# Altium schematic sheet mcu2.SchDoc
size A4
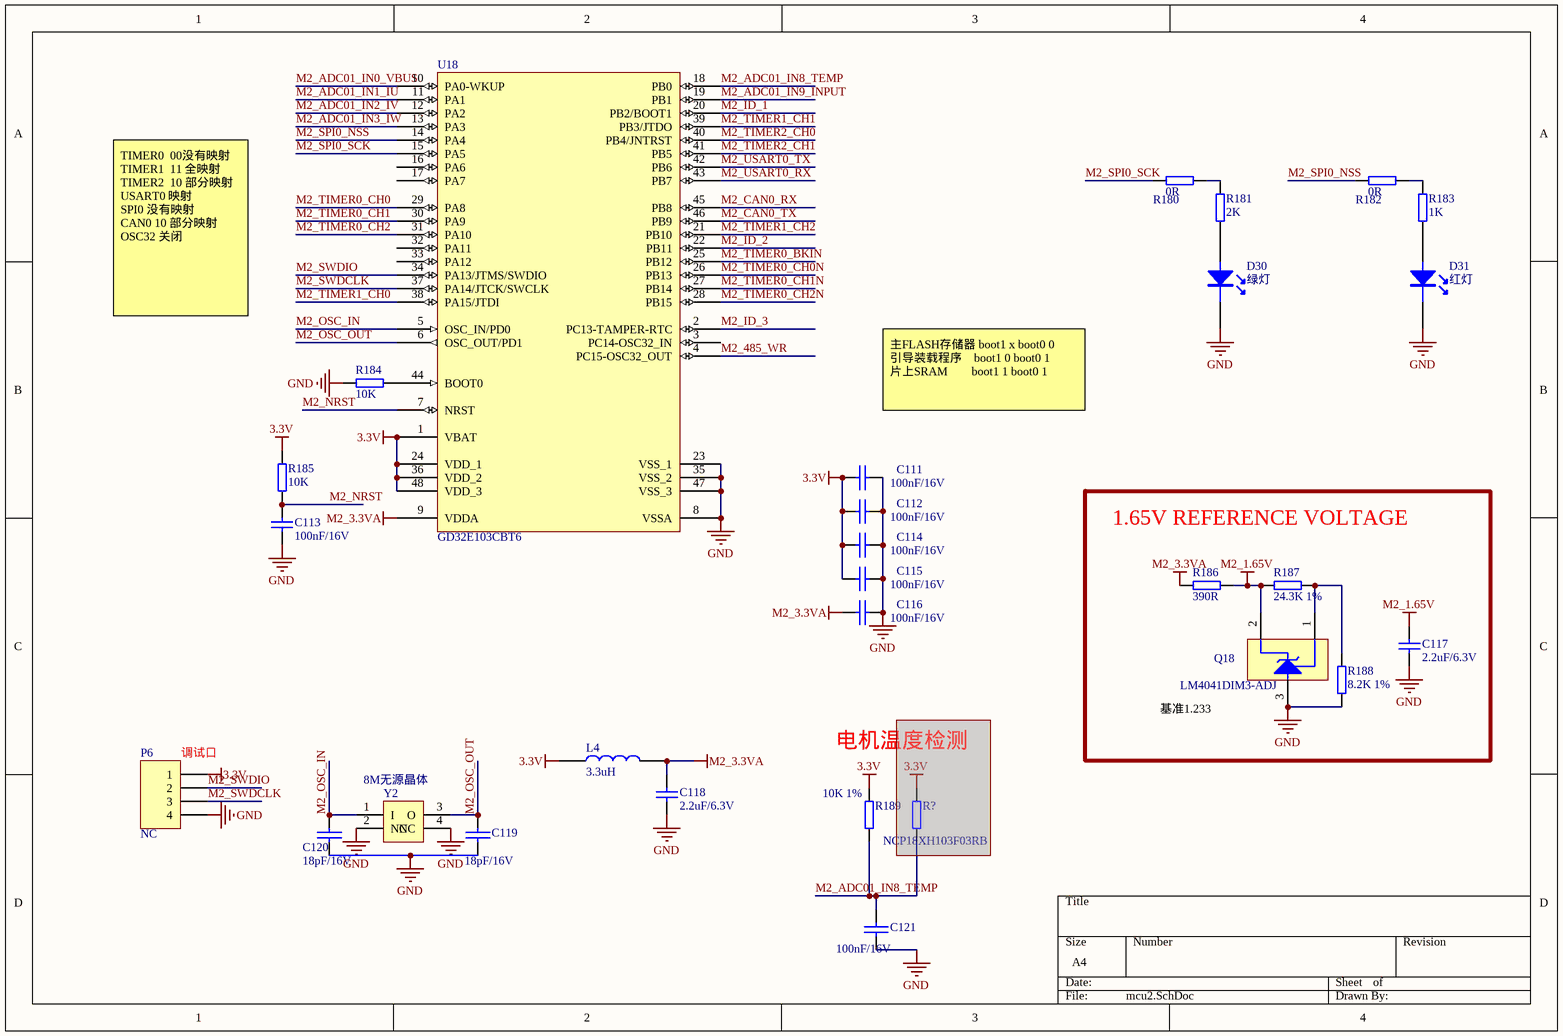
[diagram p0: mcu2.SchDoc]

## Parts
C111  100nF/16V  [C0402]
C112  100nF/16V  [C0402]
C113  100nF/16V  [C0402]
C114  100nF/16V  [C0402]
C115  100nF/16V  [C0402]
C116  100nF/16V  [C0402]
C117  2.2uF/6.3V  [C0402]
C118  2.2uF/6.3V  [C0402]
C119  18pF/16V  [C0402]
C120  18pF/16V  [C0402]
C121  100nF/16V  [C0402]
D30  绿灯  [LED_0603]
D31  红灯  [LED_0603]
L4  3.3uH  [L0603]
P6  NC  [2.0*4]
Q18  LM4041DIM3-ADJ  [SOT-23]
R180  0R  [R0603]
R181  2K  [R0402]
R182  0R  [R0603]
R183  1K  [R0402]
R184  10K  [R0402]
R185  10K  [R0402]
R186  390R  [R0603]
R187  24.3K 1%  [R0402]
R188  8.2K 1%  [R0402]
R189  10K 1%  [R0402]
R?  NCP18XH103F03RB  [R0603]  (masked out: inside a compile mask, not in the netlist)
U18  GD32E103CBT6  [LQFP-48]
Y2  8M无源晶体  [5032 4pin]

## Blocks framed on the sheet
1.65V REFERENCE VOLTAGE: C117 Q18 R186-R188

## Nets
3.3V: C111.2 C112.2 C114.2 C115.2 L4.1 P6.1 R185.2 R189.2 U18.1(VBAT) U18.24(VDD_1) U18.36(VDD_2) U18.48(VDD_3)
GND: C111.1 C112.1 C113.1 C114.1 C115.1 C116.1 C117.1 C118.1 C119.1 C120.1 C121.2 D30.2(K) D31.2(K) P6.4 Q18.3 R184.1 R188.2 U18.8(VSSA) U18.23(VSS_1) U18.35(VSS_2) U18.47(VSS_3) Y2.2(NC) Y2.4(NC)
M2_1.65V: C117.2 Q18.2 R186.2 R187.1
M2_3.3VA: C116.2 C118.2 L4.2 R186.1 U18.9(VDDA)
M2_485_WR: U18.4(PC15-OSC32_OUT)
M2_ADC01_IN0_VBUS: U18.10(PA0-WKUP)
M2_ADC01_IN1_IU: U18.11(PA1)
M2_ADC01_IN2_IV: U18.12(PA2)
M2_ADC01_IN3_IW: U18.13(PA3)
M2_ADC01_IN8_TEMP: C121.1 R189.1 U18.18(PB0)
M2_ADC01_IN9_INPUT: U18.19(PB1)
M2_CAN0_RX: U18.45(PB8)
M2_CAN0_TX: U18.46(PB9)
M2_ID_1: U18.20(PB2/BOOT1)
M2_ID_2: U18.22(PB11)
M2_ID_3: U18.2(PC13-TAMPER-RTC)
M2_NRST: C113.2 R185.1 U18.7(NRST)
M2_OSC_IN: C120.2 U18.5(OSC_IN/PD0) Y2.1(I)
M2_OSC_OUT: C119.2 U18.6(OSC_OUT/PD1) Y2.3(O)
M2_SPI0_NSS: R182.2 U18.14(PA4)
M2_SPI0_SCK: R180.2 U18.15(PA5)
M2_SWDCLK: P6.3 U18.37(PA14/JTCK/SWCLK)
M2_SWDIO: P6.2 U18.34(PA13/JTMS/SWDIO)
M2_TIMER0_BKIN: U18.25(PB12)
M2_TIMER0_CH0: U18.29(PA8)
M2_TIMER0_CH0N: U18.26(PB13)
M2_TIMER0_CH1: U18.30(PA9)
M2_TIMER0_CH1N: U18.27(PB14)
M2_TIMER0_CH2: U18.31(PA10)
M2_TIMER0_CH2N: U18.28(PB15)
M2_TIMER1_CH0: U18.38(PA15/JTDI)
M2_TIMER1_CH1: U18.39(PB3/JTDO)
M2_TIMER1_CH2: U18.21(PB10)
M2_TIMER2_CH0: U18.40(PB4/JNTRST)
M2_TIMER2_CH1: U18.41(PB5)
M2_USART0_RX: U18.43(PB7)
M2_USART0_TX: U18.42(PB6)
NetD30_1: D30.1(A) R181.2
NetD31_1: D31.1(A) R183.2
NetQ18_1: Q18.1 R187.2 R188.1
NetR180_1: R180.1 R181.1
NetR182_1: R182.1 R183.1
NetR184_2: R184.2 U18.44(BOOT0)

Not connected (* = marked no-connect by the designer): U18 3(PC14-OSC32_IN) 16(PA6) 17(PA7) 32(PA11) 33(PA12)

## Notes on the sheet
- TIMER0  00没有映射
  TIMER1  11 全映射
  TIMER2  10 部分映射
  USART0 映射
  SPI0 没有映射
  CAN0 10 部分映射
  OSC32 关闭
- 主FLASH存储器 boot1 x boot0 0
  引导装载程序    boot1 0 boot0 1
  片上SRAM        boot1 1 boot0 1
- (near P6) 调试口
- 电机温度检测
- (near Q18) 基准1.233

## Library data of the parts
C111 C112 C114-C116 C119-C121 = CAP: Capacitor
C113 C117 C118 = cap
D30 = LED: 绿灯led
D31 = LED: 红灯led
L4 = INDUCTOR: 贴片电感
P6 = 排针2mm,1*4: 空，无器件; LatestRevisionDate: 17-Jul-2002; LatestRevisionNote: Re-released for DXP Platform.; Publisher: Altium Limited
Q18 = 3CCCCCC
R180 R182 R184-R188 = Resistance
R181 R183 R189 = R
R? = R: 风华贴片NTC 120K 5%
U18 = GD32E103CxT6: Published: *; DatasheetVersion: *; PackageVersion: *; PackageReference: *; Publisher: *; PackageDescription: *; ComponentLink1Description: *; ComponentLink1URL: *; ComponentLink2Description: *; ComponentLink2URL: *
Y2 = OSC24